# Altium schematic sheet GPS.SchDoc
size A
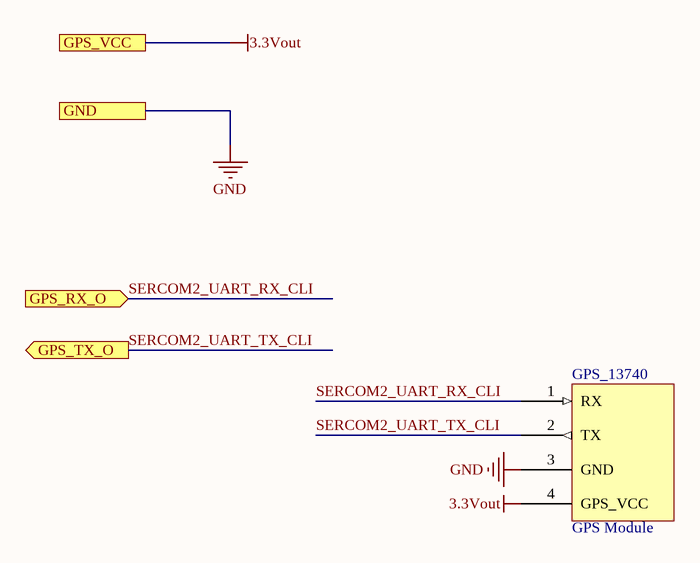
[diagram p0: GPS.SchDoc]

## Parts
GPS_13740  GPS Module  [GPS_DIP3]

## Ports
GND, GPS_RX_O (in), GPS_TX_O (out), GPS_VCC

## Nets
3.3Vout: GPS_13740.4(GPS_VCC) ; port GPS_VCC
GND: GPS_13740.3(GND) ; port GND
SERCOM2_UART_RX_CLI: GPS_13740.1(RX) ; port GPS_RX_O
SERCOM2_UART_TX_CLI: GPS_13740.2(TX) ; port GPS_TX_O

## Library data of the parts
GPS_13740 = GPS-13740: GPS RECEIVER MODULE GP-20U7; Manufacturer: SparkFun; Interface: UART; Frequency: 1.575GHz; Sensitivity: -163dBm; Supplier 1: Mouser; Manufacturer Part Number: GPS-13740; RoHS: No; Category: RF Receivers, Transceivers; Stock 1: 77; Pricing 1: 1=19.04000, 10=19.04000, 50=19.04000, 100=19.04000, 1000=19.04000, 10000=19.04000 (USD); Case/Package: Module; Min Operating Temperature: -40°C; Max Operating Temperature: 85°C; Packaging: Bulk; ComponentLink1URL: https://cdn.sparkfun.com/datasheets/GPS/GP-20U7.pdf?src-supplier=Digi-Key; ComponentLink1Description: https://cdn.sparkfun.com/datasheets/GPS/GP-20U7.pdf?src-supplier=Digi-Key; Supplier Part Number 1: 474-GPS-13740